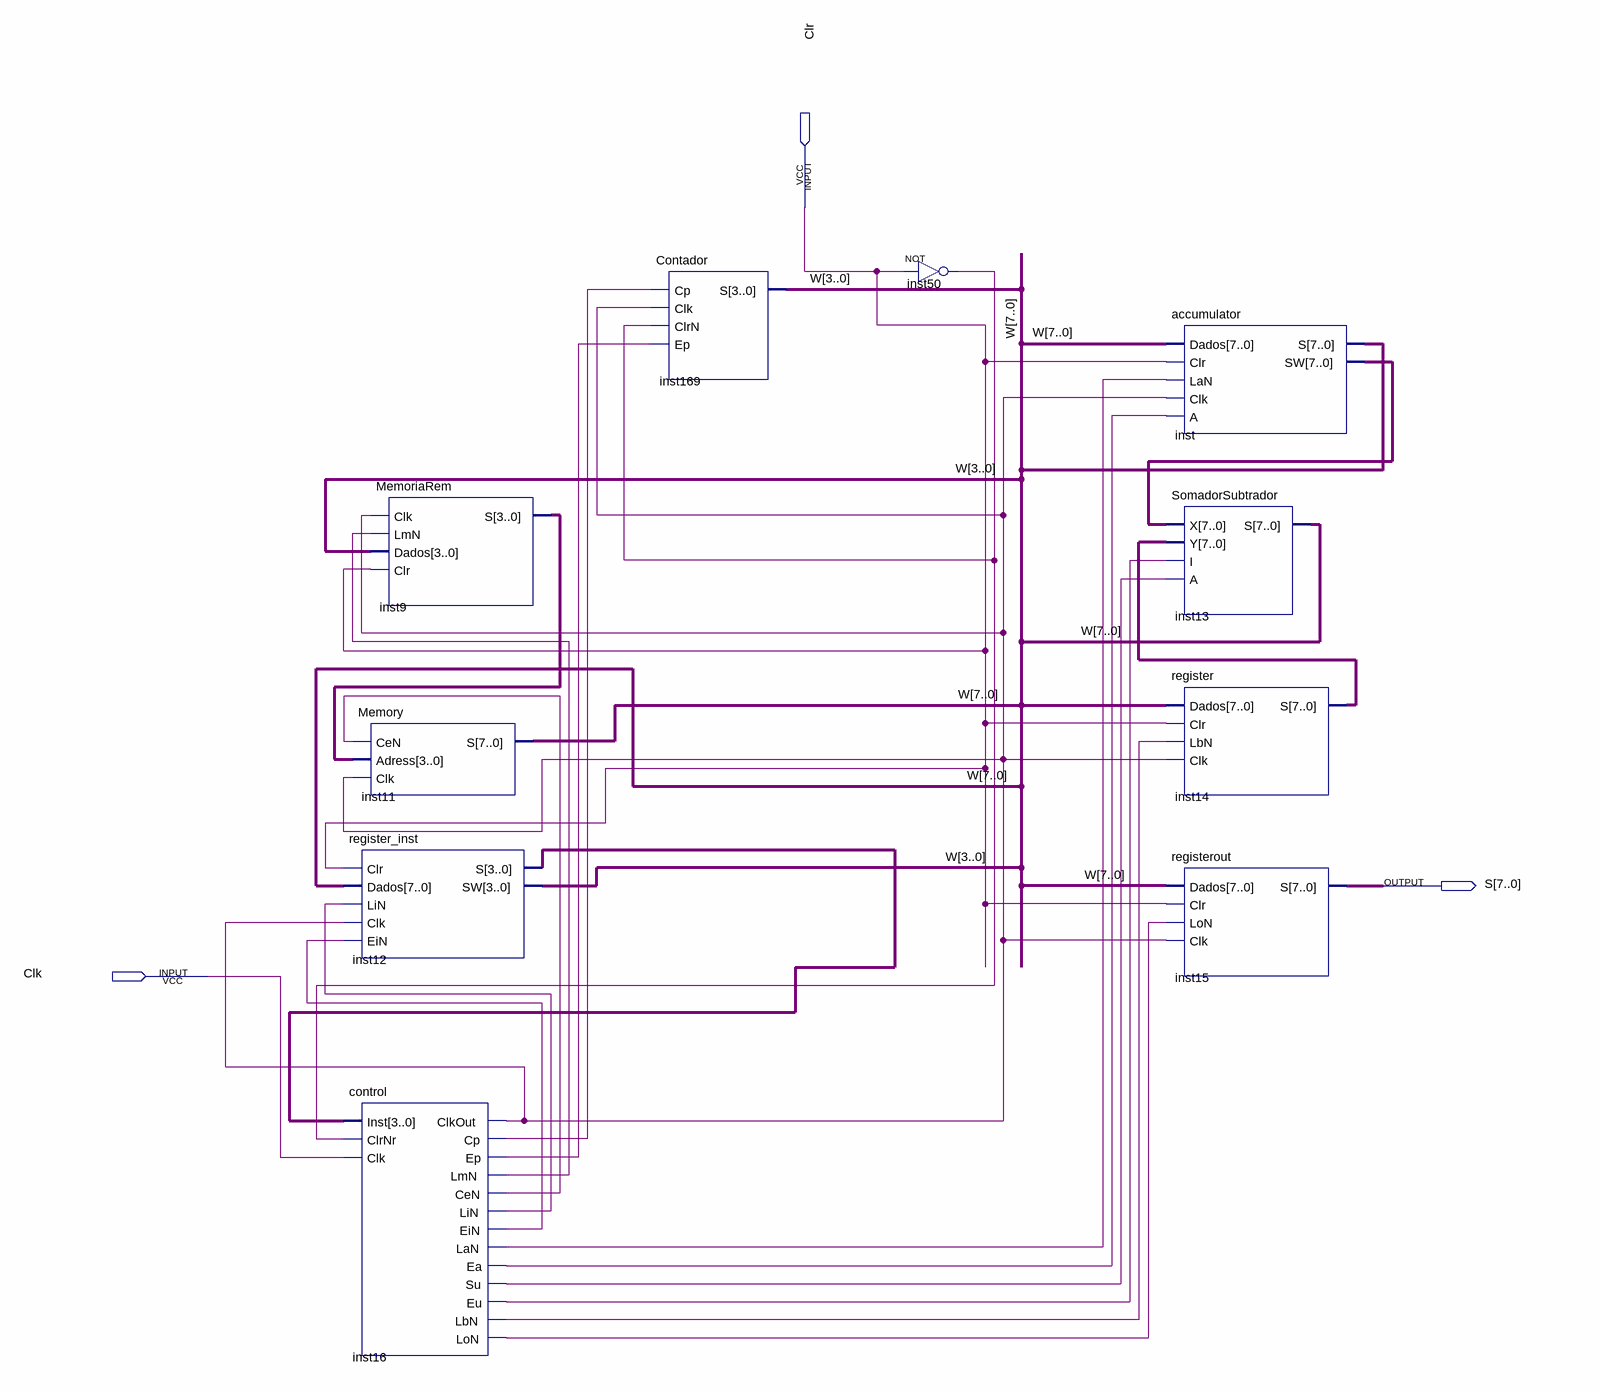
[diagram p0: schematic sheet]
// Quartus schematic MICROPROCESSADOR.bdf as structural Verilog: 10 symbols, 3 pins
module MICROPROCESSADOR (
  input  Clr,
  input  Clk,
  output [7:0] S
);

  wire inst16_cen, inst16_clkout, inst16_cp, inst16_ea, inst16_ein, inst16_ep, inst16_eu, inst16_lan,
       inst16_lbn, inst16_lin, inst16_lmn, inst16_lon, inst16_su, inst50_out;
  wire [3:0] inst9_s, inst12_s;
  wire [7:0] inst14_s, inst_sw, W;

  MemoriaRem inst9 (.Clk(inst16_clkout), .LmN(inst16_lmn), .Dados(W[3:0]), .Clr(Clr), .S(inst9_s));
  Memory inst11 (.CeN(inst16_cen), .Adress(inst9_s), .Clk(inst16_clkout), .S(W));
  register_inst inst12 (
    .Clr(Clr), .Dados(W), .LiN(inst16_lin), .Clk(inst16_clkout), .EiN(inst16_ein), .S(inst12_s), .SW(W[3:0]));
  control inst16 (
    .Inst(inst12_s), .ClrNr(inst50_out), .Clk(Clk), .ClkOut(inst16_clkout), .Cp(inst16_cp), .Ep(inst16_ep),
    .LmN(inst16_lmn), .CeN(inst16_cen), .LiN(inst16_lin), .EiN(inst16_ein), .LaN(inst16_lan), .Ea(inst16_ea),
    .Su(inst16_su), .Eu(inst16_eu), .LbN(inst16_lbn), .LoN(inst16_lon));
  Contador inst169 (.Cp(inst16_cp), .Clk(inst16_clkout), .ClrN(inst50_out), .Ep(inst16_ep), .S(W[3:0]));
  not inst50 (inst50_out, Clr);
  accumulator inst (.Dados(W), .Clr(Clr), .LaN(inst16_lan), .Clk(inst16_clkout), .A(inst16_ea), .S(W), .SW(inst_sw));
  SomadorSubtrador inst13 (.X(inst_sw), .Y(inst14_s), .I(inst16_eu), .A(inst16_su), .S(W));
  register inst14 (.Dados(W), .Clr(Clr), .LbN(inst16_lbn), .Clk(inst16_clkout), .S(inst14_s));
  registerout inst15 (.Dados(W), .Clr(Clr), .LoN(inst16_lon), .Clk(inst16_clkout), .S(S));
endmodule
